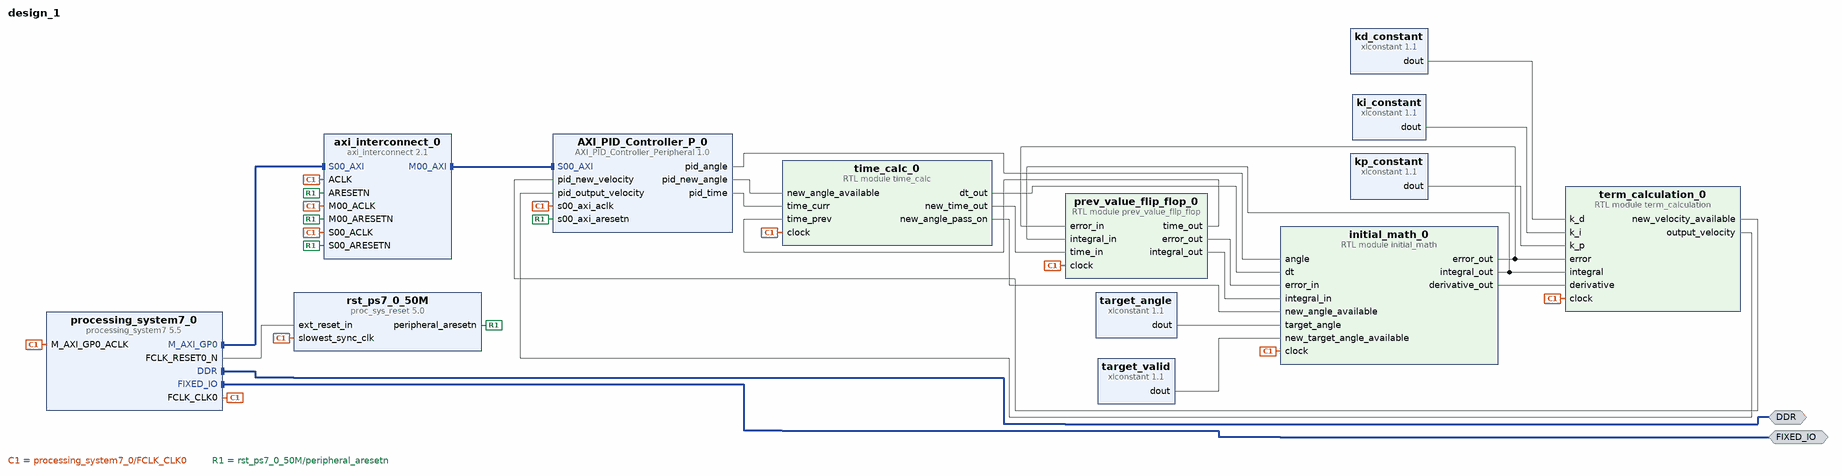
[diagram p0: block diagram of the top level]
# Vivado block design design_1, xc7z010clg400-1, Vivado 2021.1
create_bd_design design_1

create_bd_intf_port -mode Master -vlnv xilinx.com:interface:ddrx_rtl:1.0 DDR
create_bd_intf_port -mode Master -vlnv xilinx.com:display_processing_system7:fixedio_rtl:1.0 FIXED_IO

create_bd_cell -type ip -vlnv xilinx.com:ip:processing_system7:5.5 processing_system7_0
set_property -dict [list \
  CONFIG.PCW_APU_PERIPHERAL_FREQMHZ 666.666666 \
  CONFIG.PCW_ENET0_ENET0_IO {MIO 16 .. 27} \
  CONFIG.PCW_ENET0_GRP_MDIO_ENABLE 1 \
  CONFIG.PCW_ENET0_GRP_MDIO_IO {MIO 52 .. 53} \
  CONFIG.PCW_ENET0_PERIPHERAL_ENABLE 1 \
  CONFIG.PCW_ENET0_RESET_ENABLE 0 \
  CONFIG.PCW_ENET_RESET_ENABLE 1 \
  CONFIG.PCW_ENET_RESET_SELECT {Share reset pin} \
  CONFIG.PCW_GPIO_MIO_GPIO_ENABLE 1 \
  CONFIG.PCW_GPIO_MIO_GPIO_IO MIO \
  CONFIG.PCW_I2C_RESET_ENABLE 1 \
  CONFIG.PCW_PRESET_BANK1_VOLTAGE {LVCMOS 1.8V} \
  CONFIG.PCW_QSPI_GRP_FBCLK_ENABLE 1 \
  CONFIG.PCW_QSPI_GRP_FBCLK_IO {MIO 8} \
  CONFIG.PCW_QSPI_GRP_SINGLE_SS_ENABLE 1 \
  CONFIG.PCW_QSPI_GRP_SINGLE_SS_IO {MIO 1 .. 6} \
  CONFIG.PCW_QSPI_PERIPHERAL_ENABLE 1 \
  CONFIG.PCW_QSPI_QSPI_IO {MIO 1 .. 6} \
  CONFIG.PCW_SD0_GRP_CD_ENABLE 1 \
  CONFIG.PCW_SD0_GRP_CD_IO {MIO 47} \
  CONFIG.PCW_SD0_GRP_WP_ENABLE 0 \
  CONFIG.PCW_SD0_PERIPHERAL_ENABLE 1 \
  CONFIG.PCW_SD0_SD0_IO {MIO 40 .. 45} \
  CONFIG.PCW_SDIO_PERIPHERAL_FREQMHZ 50 \
  CONFIG.PCW_SINGLE_QSPI_DATA_MODE x4 \
  CONFIG.PCW_UART1_PERIPHERAL_ENABLE 1 \
  CONFIG.PCW_UART1_UART1_IO {MIO 48 .. 49} \
  CONFIG.PCW_UART_PERIPHERAL_FREQMHZ 100 \
  CONFIG.PCW_UIPARAM_DDR_FREQ_MHZ 533.333333 \
  CONFIG.PCW_UIPARAM_DDR_MEMORY_TYPE {DDR 3 (Low Voltage)} \
  CONFIG.PCW_UIPARAM_DDR_PARTNO {MT41K256M16 RE-125} \
  CONFIG.PCW_USB0_PERIPHERAL_ENABLE 1 \
  CONFIG.PCW_USB0_RESET_ENABLE 1 \
  CONFIG.PCW_USB0_RESET_IO {MIO 46} \
  CONFIG.PCW_USB0_USB0_IO {MIO 28 .. 39} \
  CONFIG.PCW_USB_RESET_ENABLE 1 \
  CONFIG.PCW_USB_RESET_SELECT {Share reset pin} \
] [get_bd_cells processing_system7_0]
# 296 more settings of processing_system7_0 are not shown: defaults, MIO pin electricals, DDR timing, and values the tool derives
create_bd_cell -type ip -vlnv xilinx.com:ip:xlconstant:1.1 kp_constant
set_property -dict {CONFIG.CONST_WIDTH 32} [get_bd_cells kp_constant]
create_bd_cell -type ip -vlnv xilinx.com:ip:xlconstant:1.1 kd_constant
set_property -dict {CONFIG.CONST_VAL 0 CONFIG.CONST_WIDTH 32} [get_bd_cells kd_constant]
create_bd_cell -type ip -vlnv xilinx.com:ip:xlconstant:1.1 ki_constant
set_property -dict {CONFIG.CONST_VAL 0 CONFIG.CONST_WIDTH 32} [get_bd_cells ki_constant]
create_bd_cell -type ip -vlnv user.org:user:AXI_PID_Controller_Peripheral:1.0 AXI_PID_Controller_P_0
create_bd_cell -type ip -vlnv xilinx.com:ip:axi_interconnect:2.1 axi_interconnect_0
set_property -dict {CONFIG.NUM_MI 1} [get_bd_cells axi_interconnect_0]
create_bd_cell -type ip -vlnv xilinx.com:ip:proc_sys_reset:5.0 rst_ps7_0_50M
create_bd_cell -type ip -vlnv xilinx.com:ip:xlconstant:1.1 target_angle
set_property -dict {CONFIG.CONST_VAL 0 CONFIG.CONST_WIDTH 32} [get_bd_cells target_angle]
create_bd_cell -type ip -vlnv xilinx.com:ip:xlconstant:1.1 target_valid
set_property -dict {CONFIG.CONST_VAL 0} [get_bd_cells target_valid]
create_bd_cell -type module -reference time_calc time_calc_0
create_bd_cell -type module -reference prev_value_flip_flop prev_value_flip_flop_0
create_bd_cell -type module -reference term_calculation term_calculation_0
create_bd_cell -type module -reference initial_math initial_math_0

# ---- connections ----

connect_bd_intf_net [get_bd_intf_pins axi_interconnect_0/M00_AXI] [get_bd_intf_pins AXI_PID_Controller_P_0/S00_AXI]
connect_bd_intf_net [get_bd_intf_ports DDR] [get_bd_intf_pins processing_system7_0/DDR]
connect_bd_intf_net [get_bd_intf_ports FIXED_IO] [get_bd_intf_pins processing_system7_0/FIXED_IO]
connect_bd_intf_net [get_bd_intf_pins processing_system7_0/M_AXI_GP0] [get_bd_intf_pins axi_interconnect_0/S00_AXI]
connect_bd_net [get_bd_pins AXI_PID_Controller_P_0/pid_angle] [get_bd_pins initial_math_0/angle]
connect_bd_net [get_bd_pins AXI_PID_Controller_P_0/pid_new_angle] [get_bd_pins time_calc_0/new_angle_available]
connect_bd_net [get_bd_pins AXI_PID_Controller_P_0/pid_time] [get_bd_pins time_calc_0/time_curr]
connect_bd_net [get_bd_pins initial_math_0/derivative_out] [get_bd_pins term_calculation_0/derivative]
connect_bd_net [get_bd_pins initial_math_0/error_out] [get_bd_pins prev_value_flip_flop_0/error_in] [get_bd_pins term_calculation_0/error]
connect_bd_net [get_bd_pins initial_math_0/integral_out] [get_bd_pins prev_value_flip_flop_0/integral_in] [get_bd_pins term_calculation_0/integral]
connect_bd_net [get_bd_pins kd_constant/dout] [get_bd_pins term_calculation_0/k_d]
connect_bd_net [get_bd_pins ki_constant/dout] [get_bd_pins term_calculation_0/k_i]
connect_bd_net [get_bd_pins kp_constant/dout] [get_bd_pins term_calculation_0/k_p]
connect_bd_net [get_bd_pins prev_value_flip_flop_0/error_out] [get_bd_pins initial_math_0/error_in]
connect_bd_net [get_bd_pins prev_value_flip_flop_0/integral_out] [get_bd_pins initial_math_0/integral_in]
connect_bd_net [get_bd_pins prev_value_flip_flop_0/time_out] [get_bd_pins time_calc_0/time_prev]
connect_bd_net [get_bd_pins processing_system7_0/FCLK_CLK0] \
  [get_bd_pins axi_interconnect_0/ACLK] [get_bd_pins rst_ps7_0_50M/slowest_sync_clk] \
  [get_bd_pins processing_system7_0/M_AXI_GP0_ACLK] [get_bd_pins axi_interconnect_0/S00_ACLK] \
  [get_bd_pins AXI_PID_Controller_P_0/s00_axi_aclk] [get_bd_pins axi_interconnect_0/M00_ACLK] [get_bd_pins time_calc_0/clock] \
  [get_bd_pins prev_value_flip_flop_0/clock] [get_bd_pins term_calculation_0/clock] [get_bd_pins initial_math_0/clock]
connect_bd_net [get_bd_pins processing_system7_0/FCLK_RESET0_N] [get_bd_pins rst_ps7_0_50M/ext_reset_in]
connect_bd_net [get_bd_pins rst_ps7_0_50M/peripheral_aresetn] \
  [get_bd_pins axi_interconnect_0/ARESETN] [get_bd_pins axi_interconnect_0/S00_ARESETN] \
  [get_bd_pins AXI_PID_Controller_P_0/s00_axi_aresetn] [get_bd_pins axi_interconnect_0/M00_ARESETN]
connect_bd_net [get_bd_pins target_angle/dout] [get_bd_pins initial_math_0/target_angle]
connect_bd_net [get_bd_pins term_calculation_0/new_velocity_available] [get_bd_pins AXI_PID_Controller_P_0/pid_new_velocity]
connect_bd_net [get_bd_pins term_calculation_0/output_velocity] [get_bd_pins AXI_PID_Controller_P_0/pid_output_velocity]
connect_bd_net [get_bd_pins time_calc_0/dt_out] [get_bd_pins initial_math_0/dt]
connect_bd_net [get_bd_pins time_calc_0/new_angle_pass_on] [get_bd_pins initial_math_0/new_angle_available]
connect_bd_net [get_bd_pins time_calc_0/new_time_out] [get_bd_pins prev_value_flip_flop_0/time_in]
connect_bd_net -net xlconstant_0_dout [get_bd_pins target_valid/dout] [get_bd_pins initial_math_0/new_target_angle_available]

# ---- address map ----
assign_bd_address -offset 0x43C00000 -range 64K -target_address_space [get_bd_addr_spaces processing_system7_0/Data] [get_bd_addr_segs AXI_PID_Controller_P_0/S00_AXI/S00_AXI_reg]

validate_bd_design
save_bd_design
